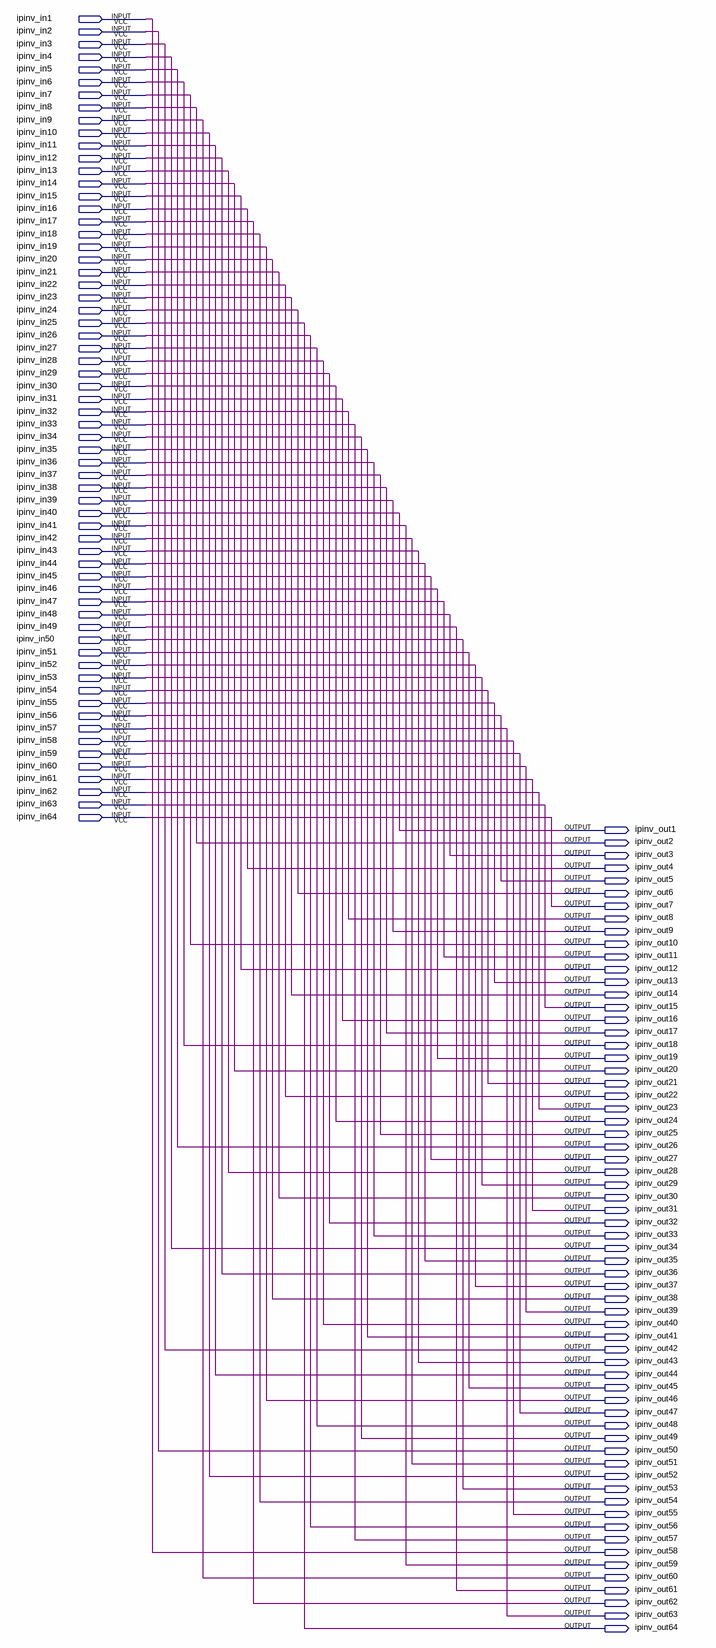
[diagram p0: schematic sheet]
// Quartus schematic IP_inv.bdf as structural Verilog: 0 symbols, 128 pins
module IP_inv (
  input  ipinv_in1,
  input  ipinv_in2,
  input  ipinv_in3,
  input  ipinv_in4,
  input  ipinv_in5,
  input  ipinv_in6,
  input  ipinv_in7,
  input  ipinv_in8,
  input  ipinv_in9,
  input  ipinv_in10,
  input  ipinv_in11,
  input  ipinv_in12,
  input  ipinv_in13,
  input  ipinv_in14,
  input  ipinv_in15,
  input  ipinv_in16,
  input  ipinv_in17,
  input  ipinv_in18,
  input  ipinv_in19,
  input  ipinv_in20,
  input  ipinv_in21,
  input  ipinv_in22,
  input  ipinv_in23,
  input  ipinv_in24,
  input  ipinv_in25,
  input  ipinv_in26,
  input  ipinv_in27,
  input  ipinv_in28,
  input  ipinv_in29,
  input  ipinv_in30,
  input  ipinv_in31,
  input  ipinv_in32,
  input  ipinv_in33,
  input  ipinv_in34,
  input  ipinv_in35,
  input  ipinv_in36,
  input  ipinv_in37,
  input  ipinv_in38,
  input  ipinv_in39,
  input  ipinv_in40,
  input  ipinv_in41,
  input  ipinv_in42,
  input  ipinv_in43,
  input  ipinv_in44,
  input  ipinv_in45,
  input  ipinv_in46,
  input  ipinv_in47,
  input  ipinv_in48,
  input  ipinv_in49,
  input  ipinv_in50,
  input  ipinv_in51,
  input  ipinv_in52,
  input  ipinv_in53,
  input  ipinv_in54,
  input  ipinv_in55,
  input  ipinv_in56,
  input  ipinv_in57,
  input  ipinv_in58,
  input  ipinv_in59,
  input  ipinv_in60,
  input  ipinv_in61,
  input  ipinv_in62,
  input  ipinv_in63,
  input  ipinv_in64,
  output ipinv_out1,
  output ipinv_out2,
  output ipinv_out3,
  output ipinv_out4,
  output ipinv_out5,
  output ipinv_out6,
  output ipinv_out7,
  output ipinv_out8,
  output ipinv_out9,
  output ipinv_out10,
  output ipinv_out11,
  output ipinv_out12,
  output ipinv_out13,
  output ipinv_out14,
  output ipinv_out15,
  output ipinv_out16,
  output ipinv_out17,
  output ipinv_out18,
  output ipinv_out19,
  output ipinv_out20,
  output ipinv_out21,
  output ipinv_out22,
  output ipinv_out23,
  output ipinv_out24,
  output ipinv_out25,
  output ipinv_out26,
  output ipinv_out27,
  output ipinv_out28,
  output ipinv_out29,
  output ipinv_out30,
  output ipinv_out31,
  output ipinv_out32,
  output ipinv_out33,
  output ipinv_out34,
  output ipinv_out35,
  output ipinv_out36,
  output ipinv_out37,
  output ipinv_out38,
  output ipinv_out39,
  output ipinv_out40,
  output ipinv_out41,
  output ipinv_out42,
  output ipinv_out43,
  output ipinv_out44,
  output ipinv_out45,
  output ipinv_out46,
  output ipinv_out47,
  output ipinv_out48,
  output ipinv_out49,
  output ipinv_out50,
  output ipinv_out51,
  output ipinv_out52,
  output ipinv_out53,
  output ipinv_out54,
  output ipinv_out55,
  output ipinv_out56,
  output ipinv_out57,
  output ipinv_out58,
  output ipinv_out59,
  output ipinv_out60,
  output ipinv_out61,
  output ipinv_out62,
  output ipinv_out63,
  output ipinv_out64
);


  assign ipinv_out1 = ipinv_in40;
  assign ipinv_out2 = ipinv_in8;
  assign ipinv_out3 = ipinv_in48;
  assign ipinv_out4 = ipinv_in16;
  assign ipinv_out5 = ipinv_in56;
  assign ipinv_out6 = ipinv_in24;
  assign ipinv_out7 = ipinv_in64;
  assign ipinv_out8 = ipinv_in32;
  assign ipinv_out9 = ipinv_in39;
  assign ipinv_out10 = ipinv_in7;
  assign ipinv_out11 = ipinv_in47;
  assign ipinv_out12 = ipinv_in15;
  assign ipinv_out13 = ipinv_in55;
  assign ipinv_out14 = ipinv_in23;
  assign ipinv_out15 = ipinv_in63;
  assign ipinv_out16 = ipinv_in31;
  assign ipinv_out17 = ipinv_in38;
  assign ipinv_out18 = ipinv_in6;
  assign ipinv_out19 = ipinv_in46;
  assign ipinv_out20 = ipinv_in14;
  assign ipinv_out21 = ipinv_in54;
  assign ipinv_out22 = ipinv_in22;
  assign ipinv_out23 = ipinv_in62;
  assign ipinv_out24 = ipinv_in30;
  assign ipinv_out25 = ipinv_in37;
  assign ipinv_out26 = ipinv_in5;
  assign ipinv_out27 = ipinv_in45;
  assign ipinv_out28 = ipinv_in13;
  assign ipinv_out29 = ipinv_in53;
  assign ipinv_out30 = ipinv_in21;
  assign ipinv_out31 = ipinv_in61;
  assign ipinv_out32 = ipinv_in29;
  assign ipinv_out33 = ipinv_in36;
  assign ipinv_out34 = ipinv_in4;
  assign ipinv_out35 = ipinv_in44;
  assign ipinv_out36 = ipinv_in12;
  assign ipinv_out37 = ipinv_in52;
  assign ipinv_out38 = ipinv_in20;
  assign ipinv_out39 = ipinv_in60;
  assign ipinv_out40 = ipinv_in28;
  assign ipinv_out41 = ipinv_in35;
  assign ipinv_out42 = ipinv_in3;
  assign ipinv_out43 = ipinv_in43;
  assign ipinv_out44 = ipinv_in11;
  assign ipinv_out45 = ipinv_in51;
  assign ipinv_out46 = ipinv_in19;
  assign ipinv_out47 = ipinv_in59;
  assign ipinv_out48 = ipinv_in27;
  assign ipinv_out49 = ipinv_in34;
  assign ipinv_out50 = ipinv_in2;
  assign ipinv_out51 = ipinv_in42;
  assign ipinv_out52 = ipinv_in10;
  assign ipinv_out53 = ipinv_in50;
  assign ipinv_out54 = ipinv_in18;
  assign ipinv_out55 = ipinv_in58;
  assign ipinv_out56 = ipinv_in26;
  assign ipinv_out57 = ipinv_in33;
  assign ipinv_out58 = ipinv_in1;
  assign ipinv_out59 = ipinv_in41;
  assign ipinv_out60 = ipinv_in9;
  assign ipinv_out61 = ipinv_in49;
  assign ipinv_out62 = ipinv_in17;
  assign ipinv_out63 = ipinv_in57;
  assign ipinv_out64 = ipinv_in25;
endmodule
